# EAGLE design USB-DMX-ISOLATED (EAGLE 7.6.0)
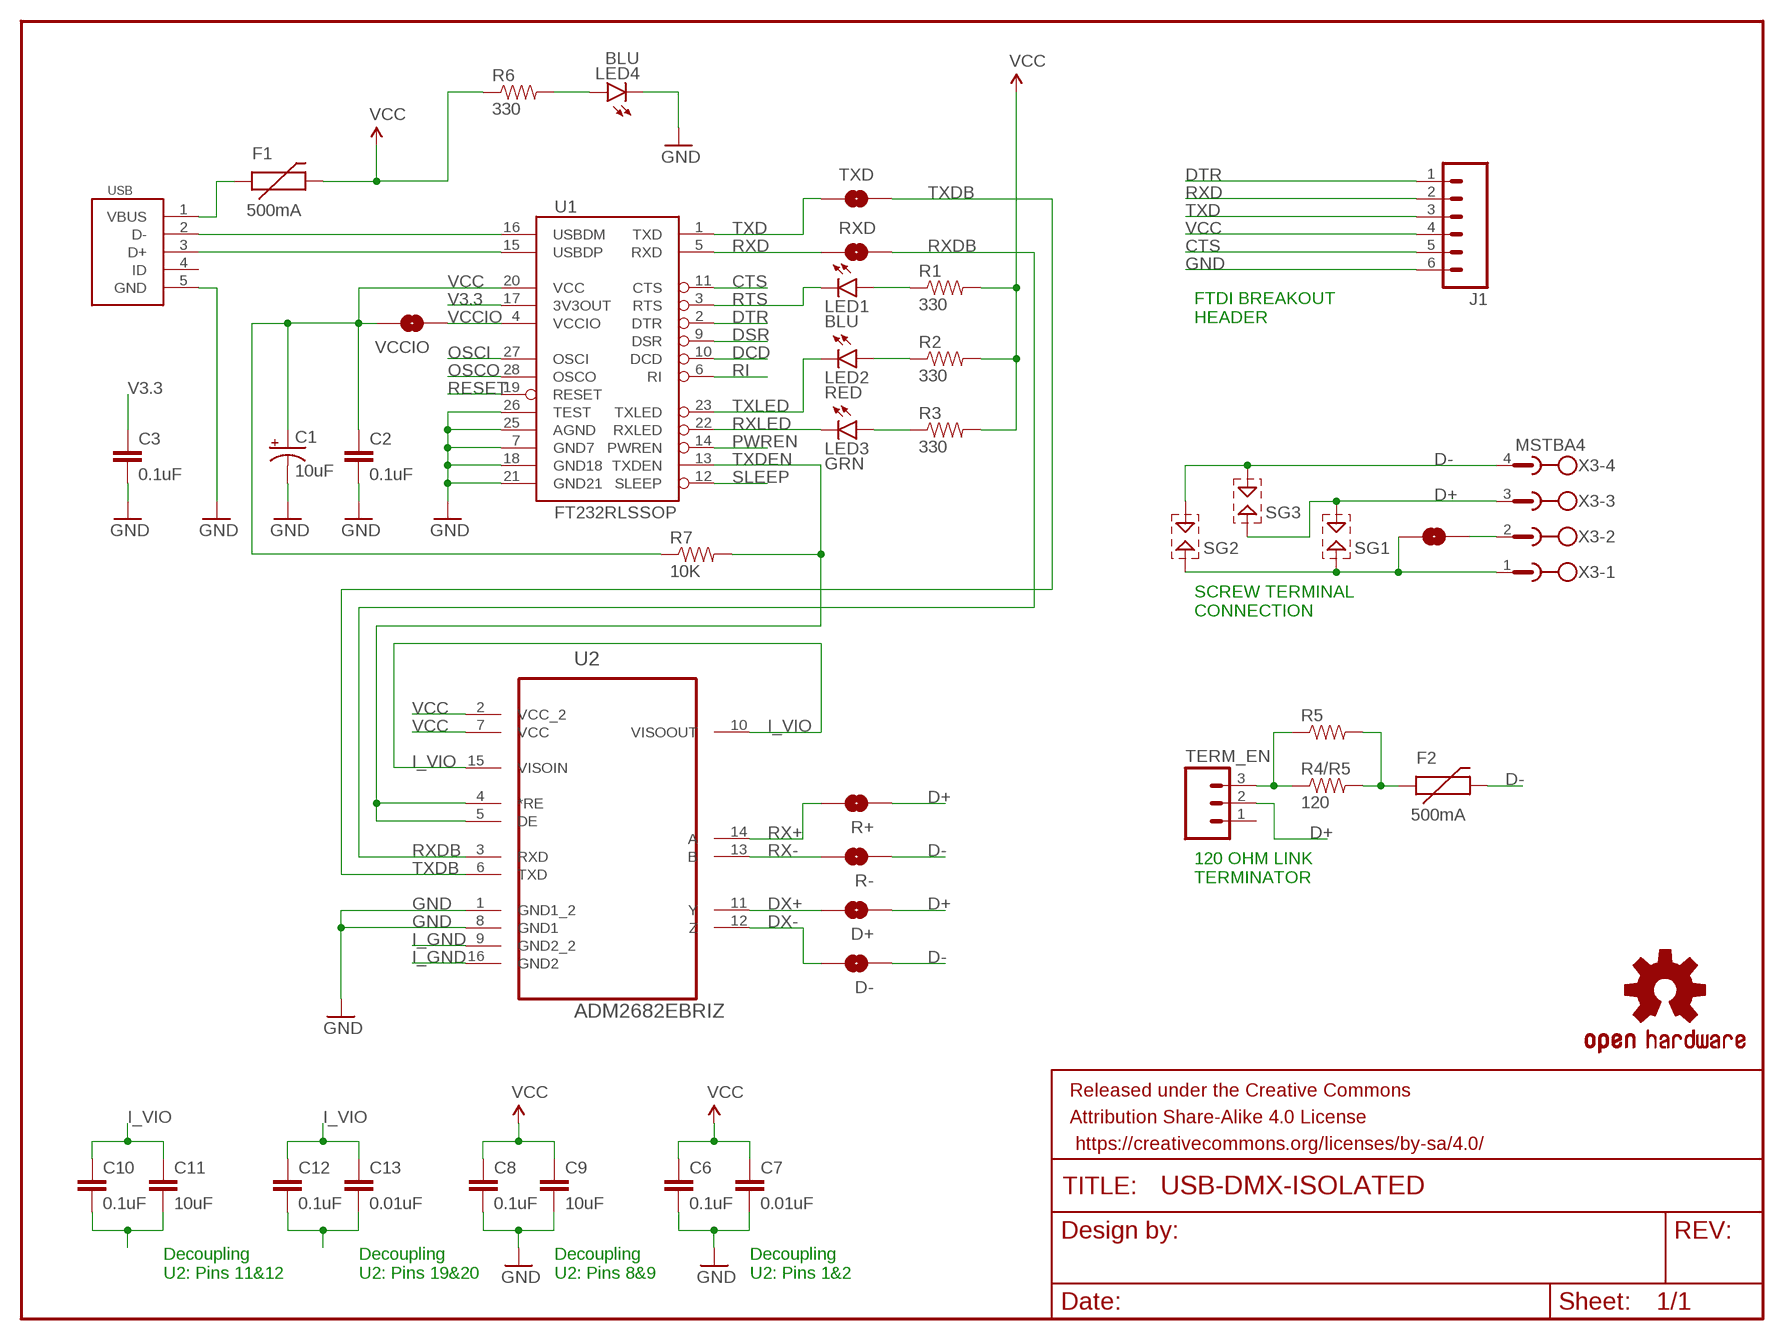
[diagram p0: schematic, sheet 1]

## Parts
C1  10uF  10UF-16V-10%(TANT)  [EIA3216]
C2  0.1uF  CAP1206  [1206]
C3  0.1uF  CAP1206  [1206]
C6  0.1uF  CAP1206  [1206]
C7  0.01uF  CAP1206  [1206]
C8  0.1uF  CAP1206  [1206]
C9  10uF  CAP1206  [1206]
C10  0.1uF  CAP1206  [1206]
C11  10uF  CAP1206  [1206]
C12  0.1uF  CAP1206  [1206]
C13  0.01uF  CAP1206  [1206]
D+  SOLDERJUMPERTRACE  [SJ_2S-TRACE]
D-  SOLDERJUMPERTRACE  [SJ_2S-TRACE]
F1  500mA  PTCSMD  [PTC-1206]
F2  500mA  PTCSMD  [PTC-1206]
FRAME1  FRAME-LETTERNO_PACKAGE  [DUMMY]
J1  M06LOCK  [1X06_LOCK]
LED1  BLU  LED1206  [LED-1206]
LED2  RED  LED1206  [LED-1206]
LED3  GRN  LED1206  [LED-1206]
LED4  BLU  LED1206  [LED-1206]
LOGO1  OSHW-LOGOS  [OSHW-LOGO-S]
P2_COM  SOLDERJUMPERTRACE  [SJ_2S-TRACE]
R1  330  RESISTOR1206  [1206]
R2  330  RESISTOR1206  [1206]
R3  330  RESISTOR1206  [1206]
R4/R5  120  RESISTOR1206  [1206]
R5  RESISTORPTH-1W  [AXIAL-0.6]
R6  330  RESISTOR1206  [1206]
R7  10K  RESISTOR1206  [1206]
R+  SOLDERJUMPERTRACE  [SJ_2S-TRACE]
R-  SOLDERJUMPERTRACE  [SJ_2S-TRACE]
RXD  SOLDERJUMPERTRACE  [SJ_2S-TRACE]
SG1  SPARK-GAP-8  [SPARK-GAP-8]
SG2  SPARK-GAP-8  [SPARK-GAP-8]
SG3  SPARK-GAP-8  [SPARK-GAP-8]
TERM_EN  M03LOCK  [1X03_LOCK]
TXD  SOLDERJUMPERTRACE  [SJ_2S-TRACE]
U1  FT232RLSSOP  [SSOP28DB]
U2  ADM2682EBRIZ  [SOIC127P1032X265-16N]
USB  USB-CON-5PIN-105017-0001  [USB-MICRO-MOLEX-105017-0001]
VCCIO  SOLDERJUMPERTRACE  [SJ_2S-TRACE]
X3  MSTBA4  [MSTBA4]

## Nets
CTS: J1.5 U1.11(CTS)
D+: D+.1 R+.1 SG1.1 SG3.2 TERM_EN.2 X3.3
D-: D-.1 F2.2 R-.1 SG2.1 SG3.1 X3.4
DCD: U1.10(DCD)
DSR: U1.9(DSR)
DTR: J1.1 U1.2(DTR)
DX+: D+.2 U2.11(Y)
DX-: D-.2 U2.12(Z)
GND: C1.C(-) C2.2 C3.2 C6.2 C7.2 C8.2 C9.2 J1.6 LED4.C U1.7(GND7) U1.18(GND18) U1.21(GND21) U1.25(AGND) U1.26(TEST) U2.1(GND1_2) U2.8(GND1) USB.5(GND)
I_GND: C10.2 C11.2 C12.2 C13.2 P2_COM.1 SG1.2 SG2.2 U2.9(GND2_2) U2.16(GND2) X3.1
I_VIO: C10.1 C11.1 C12.1 C13.1 U2.10(VISOOUT) U2.15(VISOIN)
N$1: LED4.A R6.2
N$2: P2_COM.2 X3.2
N$3: R4/R5.1 R5.P$1 TERM_EN.3
N$4: F2.1 R4/R5.2 R5.P$2
N$7: LED3.A R3.1
N$8: LED1.A R1.1
N$9: LED2.A R2.1
OSCI: U1.27(OSCI)
OSCO: U1.28(OSCO)
PWREN: U1.14(PWREN)
RESET: U1.19(RESET)
RI: U1.6(RI)
RTS: LED1.C U1.3(RTS)
RX+: R+.2 U2.14(A)
RX-: R-.2 U2.13(B)
RXD: J1.2 RXD.1 U1.5(RXD)
RXDB: RXD.2 U2.3(RXD)
RXLED: LED3.C U1.22(RXLED)
SLEEP: U1.12(SLEEP)
TXD: J1.3 TXD.1 U1.1(TXD)
TXDB: TXD.2 U2.6(TXD)
TXDEN: R7.2 U1.13(TXDEN) U2.4(*RE) U2.5(DE)
TXLED: LED2.C U1.23(TXLED)
USB_D+: U1.15(USBDP) USB.3(D+)
USB_D-: U1.16(USBDM) USB.2(D-)
V3.3: C3.1 U1.17(3V3OUT)
VBUS: F1.1 USB.1(VBUS)
VCC: C1.A(+) C2.1 C6.1 C7.1 C8.1 C9.1 F1.2 J1.4 R1.2 R2.2 R3.2 R6.1 R7.1 U1.20(VCC) U2.2(VCC_2) U2.7(VCC) VCCIO.2
VCCIO: U1.4(VCCIO) VCCIO.1
Unconnected: TERM_EN.1 USB.4(ID)

## Notes on the sheet
- FTDI BREAKOUT
  HEADER
- SCREW TERMINAL
  CONNECTION
- 120 OHM LINK
  TERMINATOR
- Decoupling
  U2: Pins 11&12
- Decoupling
  U2: Pins 19&20
- Decoupling
  U2: Pins 8&9
- Decoupling
  U2: Pins 1&2

## Library data of the parts
C1 = SparkFun-Capacitors:10UF-16V-10%(TANT): CAP-00811 1206/EIA-3216 Tantalum capacitor; PROD_ID: CAP-00811
C2 C3 C6-C13 = SparkFun-Passives:CAP: Capacitor Standard 0603 ceramic capacitor, and 0.1" leaded capacitor.
D+ D- P2_COM R+ R- RXD TXD VCCIO = SparkFun-Retired:SOLDERJUMPER: Solder Jumper Standard SMD solder jumper. Used to automate production. Two varients : Normally Open and Normally Closed are the same, but have different paste layers. NC will have a large amount of paste and should jumper during reflow.
F1 F2 = SparkFun-PowerIC:PTC: Resettable Fuse PTC Resettable Fuse. Spark Fun Electronics SKU : COM-08357; PROD_ID: RES-11150
FRAME1 = SparkFun-Aesthetics:FRAME-LETTER: Schematic Frame Standard 8.5x11 US Letter frame; DESIGNER: Nobody; VERSION: v01
J1 = SparkFun-Connectors:M06: Header 6 Standard 6-pin 0.1" header. Use with straight break away headers (SKU : PRT-00116), right angle break away headers (PRT-00553), swiss pins (PRT-00743), machine pins (PRT-00117), and female headers (PRT-00115). Molex polarized connector foot print use with SKU : PRT-08094 with associated crimp pins and housings. NOTES ON THE VARIANTS LOCK and LOCK_LONGPADS... This footprint was designed to help hold the alignment of a through-hole component (i.e. 6-pin header) while soldering it into place. You may notice that each hole has been shifted either up or down by 0.005 of an inch from it's more standard position (which is a perfectly straight line). This slight alteration caused the pins (the squares in the middle) to touch the edges of the holes. Because they are alternating, it causes a "brace" to hold the component in place. 0.005 has proven to be the perfect amount of "off-center" position when using our standard breakaway headers. Although looks a little odd when you look at the bare footprint, once you have a header in there, the alteration is very hard to notice. Also,if you push a header all the way into place, it is covered up entirely on the bottom side. This idea of altering the position of holes to aid alignment will be further integrated into the Sparkfun Library for other footprints. It can help hold any component with 3 or more connection pins.
LED1-LED4 = SparkFun-LED:LED: LEDs Standard schematic elements and footprints for 5mm, 3mm, 1206, and 0603 sized LEDs. 5mm - Spark Fun Electronics SKU : COM-00529 (and others)
LOGO1 = SparkFun-Aesthetics:OSHW-LOGO: Open Source Hardware Logo This logo indicates the piece of hardware it is found on incorporates a OSHW license and/or adheres to the definition of open source hardware found here: http://freedomdefined.org/OSHW
R1-R3 R4/R5 R5-R7 = SparkFun-Passives:RESISTOR: Resistor Basic schematic elements and footprints for 0603, 1206, and PTH resistors.
SG1-SG3 = supressor:SPARK-GAP-: SPARK GAP
TERM_EN = SparkFun-Connectors:M03: Header 3 Standard 3-pin 0.1" header. Use with straight break away headers (SKU : PRT-00116), right angle break away headers (PRT-00553), swiss pins (PRT-00743), machine pins (PRT-00117), and female headers (PRT-00115). Molex polarized connector foot print use with SKU : PRT-08232 with associated crimp pins and housings.
U1 = SparkFun-DigitalIC:FT232RL: USB UART FT232RL 4th Generation USB UART (USB <-> Serial) Controller. Spark Fun Electronics SKU : COM-00650 Production SKU IC-00870; PROD_ID: IC-00870
U2 = ADI-Phase-2:ADM2682EBRIZ: TRANSCEIVER, ISO, RS485; MPN: ADM2682EBRIZ; OC_FARNELL: 2008783; OC_NEWARK: 58T8844; PACKAGE: SOIC-16-W; SUPPLIER: Analog Devices
USB = GeekAmmo:USB-CON-5PIN: Molex Micro USB 105017-0001
X3 = con-phoenix-508:MSTBA4: PHOENIX; MF: FARNELL; MPN: 1757268; OC_FARNELL: 3705195; OC_NEWARK: 71C4163

## Board
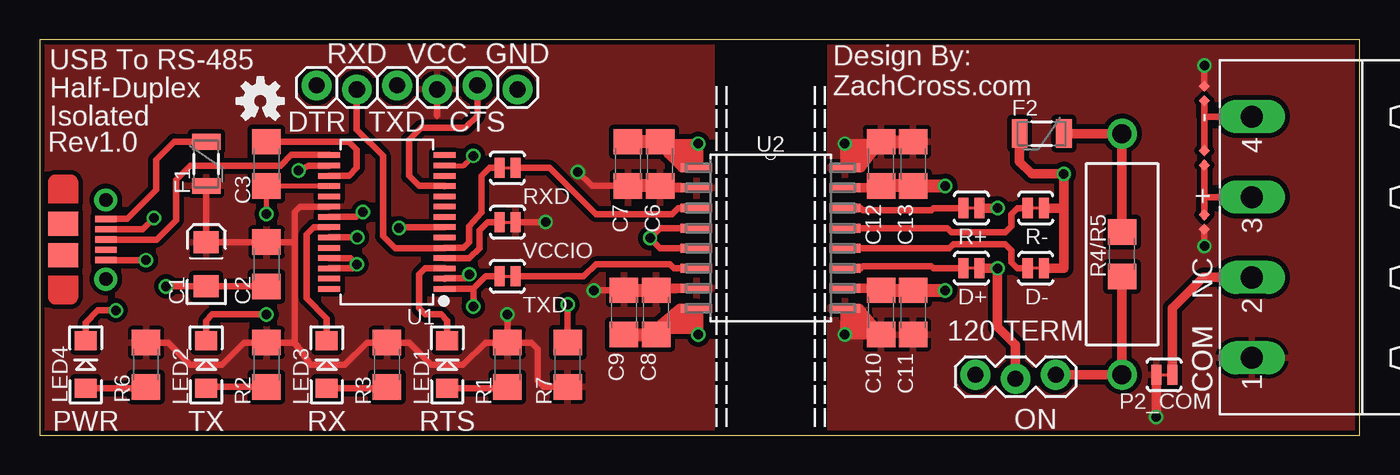
[diagram p1: board, top side]
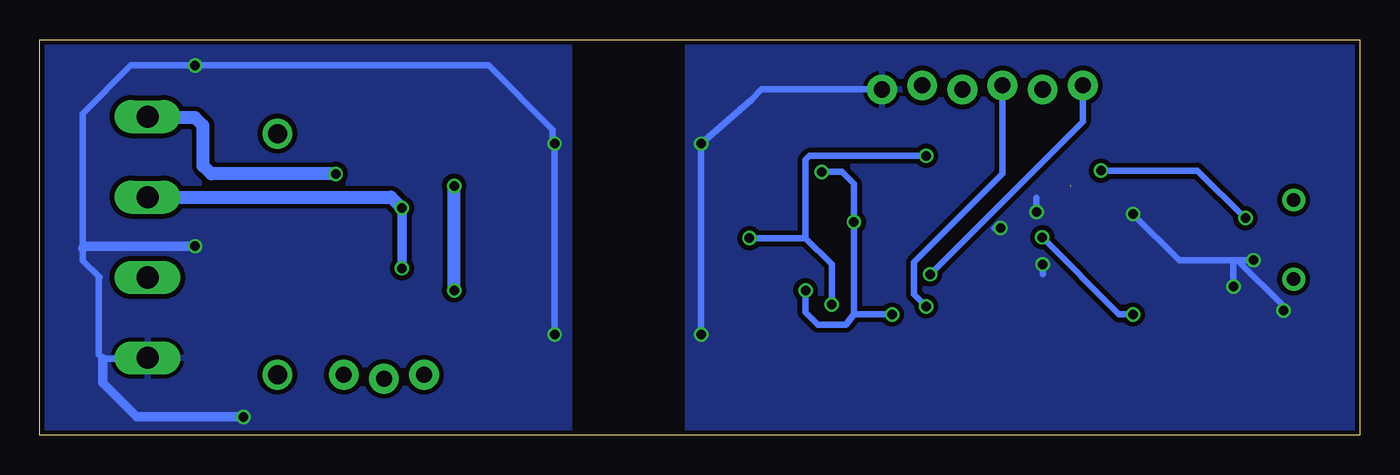
[diagram p2: board, bottom side, seen from below]

Size 83.5 x 25 mm. Coordinates in mm from the lower left corner, seen from the top.
Outline: 0,0 83.49,0 83.5,25 0,25 0,0
Copper layers (1*16): Top 0.035mm / dielectric 1.5mm / Bottom 0.035mm
Design rules "SeeedStudio_2layer_DRU_no_angle_20140221": minimum track width 6mil, minimum drill 12mil, track to track 6mil, track to pad 6mil, pad to pad 6mil, via to via 6mil, smd to smd 0mil, copper to edge 10mil, drill to drill 10mil, minimum pad ring 10mil, minimum via ring 6mil, stop-mask expansion 2mil, vias tented up to drill 100mil, thermal gap 10mil

### Footprints (pad centres in the part's own frame; a part is rotated, then mirrored left to right if it is on the bottom)
EIA3216 = smd 1.4 x 1.6: A 1.4,0; C -1.4,0
1206 = smd 1.6 x 1.8: 1 -1.4,0; 2 1.4,0
SJ_2S-TRACE = smd 0.635 x 1.27: 1 -0.508,0; 2 0.508,0
PTC-1206 = smd 1 x 1.8: 1 -1.4,0; 2 1.4,0
1X06_LOCK = drill 1.016 pad 1.88: 1 0,0; 2 2.54,-0.254; 3 5.08,0; 4 7.62,-0.254; 5 10.16,0; 6 12.7,-0.254
LED-1206 = smd 1.2 x 1.4: A -1.5,0; C 1.5,0
AXIAL-0.6 = drill 1.2 pad 1.88: P$1 -7.62,0; P$2 7.62,0
SPARK-GAP-8 = smd 0.508 x 0.508 rotated 45: 1 -0.457,0; 2 0.457,0
1X03_LOCK = drill 1.016 pad 1.88: 1 0,0.127; 2 2.54,-0.127; 3 5.08,0.127
SSOP28DB = smd 0.348 x 1.397: 1 -4.225,-3.656; 2 -3.575,-3.656; 3 -2.925,-3.656; 4 -2.275,-3.656; 5 -1.625,-3.656; 6 -0.975,-3.656; 7 -0.325,-3.656; 8 0.325,-3.656; 9 0.975,-3.656; 10 1.625,-3.656; 11 2.275,-3.656; 12 2.925,-3.656; 13 3.575,-3.656; 14 4.225,-3.656; 15 4.225,3.656; 16 3.575,3.656; 17 2.925,3.656; 18 2.275,3.656; 19 1.625,3.656; 20 0.975,3.656; 21 0.325,3.656; 22 -0.325,3.656; 23 -0.975,3.656; 24 -1.625,3.656; 25 -2.275,3.656; 26 -2.925,3.656; 27 -3.575,3.656; 28 -4.225,3.656
SOIC127P1032X265-16N = smd 1.981 x 0.559: 1 -4.699,4.445; 2 -4.699,3.175; 3 -4.699,1.905; 4 -4.699,0.635; 5 -4.699,-0.635; 6 -4.699,-1.905; 7 -4.699,-3.175; 8 -4.699,-4.445; 9 4.699,-4.445; 10 4.699,-3.175; 11 4.699,-1.905; 12 4.699,-0.635; 13 4.699,0.635; 14 4.699,1.905; 15 4.699,3.175; 16 4.699,4.445
USB-MICRO-MOLEX-105017-0001 = smd 0.4 x 1.35: 1 1.2,0; 2 1.85,0; 3 2.5,0; 4 3.15,0; 5 3.8,0 | drill 0.85 pad 1.45: P$1 0,0; P$2 5,0 | smd 1.5 x 1.9: P$3 3.5,-2.7; P$4 1.5,-2.7
MSTBA4 = drill 1.397 long: 1 -7.62,5.08; 2 -2.54,5.08; 3 2.54,5.08; 4 7.62,5.08

### Placement (x,y rotation side)
C1  10.54,10.79 90 top
C2  14.35,10.79 270 top
C3  14.35,17.14 270 top
C6  39.24,17.14 90 top
C7  37.21,17.14 90 top
C8  38.99,7.75 270 top
C9  36.96,7.75 270 top
C10  53.21,7.75 270 top
C11  55.24,7.75 270 top
C12  53.21,17.14 90 top
C13  55.24,17.14 90 top
D+  58.93,10.54 180 top
D-  62.99,10.54 180 top
F1  10.54,17.14 270 top
F2  63.37,19.05 180 top
FRAME1  -1.02,-0.25 0 top
J1  17.53,22.1 0 top
LED1  25.78,4.45 90 top
LED2  10.54,4.45 90 top
LED3  18.16,4.45 90 top
LED4  2.92,4.45 90 top
LOGO1  13.96,21.11 0 top
P2_COM  71.12,3.81 0 top
R1  29.59,4.45 90 top
R2  14.35,4.45 90 top
R3  21.97,4.45 90 top
R4/R5  68.45,11.43 90 top
R5  68.45,11.43 90 top
R6  6.73,4.45 270 top
R7  33.4,4.45 90 top
R+  58.93,14.35 180 top
R-  62.99,14.35 180 top
RXD  29.59,16.89 0 top
SG1  73.66,13.46 270 top
SG2  73.66,21.59 90 top
SG3  73.66,17.53 270 top
TERM_EN  59.18,3.68 0 top
TXD  29.59,10.03 0 top
U1  21.97,13.46 90 top
U2  46.23,12.45 0 top
USB  4.19,14.86 270 top
VCCIO  29.59,13.46 0 top
X3  81.75,12.5 90 top

### Tracks (layer width: path | path; a pad name or v marks a point on that pad's centre or on a via)
CTS
  Top 0.406: J1.5 27.69,20.19 26.92,19.43 24.13,19.43 23.37,18.67 23.37,16.38 24,15.75 25.62,15.75 U1.11
D+  (via drill 0.6)
  Top 0.406: SG3.2 73.66,15.04 | SG1.1 73.66,15.04 | X3.3 73.66,15.04
  Top 0.61: D+.1 v60.58,10.54 60.58,6.86 61.72,5.71 TERM_EN.2 | v60.58,14.35 R+.1
  Bottom 0.61: v60.58,10.54 v60.58,14.35
  Bottom 0.813: X3.3 61.27,15.04 v60.58,14.35
D-  (via drill 0.6)
  Top 0.406: X3.4 73.71,20.12 73.66,20.07 | 73.66,20.07 SG2.1 | 73.66,20.07 SG3.1 | F2.2
  Top 0.61: D-.1 64.77,10.54 64.77,14.35 | 64.77,14.35 R-.1 | 64.77,14.35 v64.77,16.51 62.74,16.51 61.98,17.27 F2.2
  Bottom 0.813: v64.77,16.51 72.64,16.51 73.15,17.02 73.15,19.56 73.66,20.07 76.62,20.07 X3.4
DTR  (via drill 0.6)
  Top 0.406: v27.18,10.16 26.92,9.91 25.65,9.91 U1.2
  Bottom 0.406: J1.1 17.53,19.81 v27.18,10.16
DX+
  Top 0.406: U2.11 51.94,10.54 52.07,10.67 56.39,10.67 56.52,10.54 D+.2
DX-
  Top 0.406: U2.12 57.53,11.81 57.78,12.06 61.09,12.06 61.47,11.68 61.47,10.92 61.85,10.54 D-.2
GND  (via drill 0.6)  (1 unrouted)
  Top 0.305: 18.31,15.74 C3.2 v14.35,13.97 | 22.79,13.14 v22.73,13.08
  Top 0.406: C2.2 C1.C v8,9.39 v8,9.4 | USB.5 v6.72,11.06 v6.73,11.05 | LED4.C 2.92,7.11 3.68,7.87 v4.83,7.87 | 40.01,18.41 39.88,18.55 C6.2 39.75,18.04 | U2.1 41.66,16.89 | 41.66,7.87 U2.8 | 39.12,6.86 39.12,6.47 C8.2 | v41.65,6.35 v41.66,6.35 | U1.7 22.79,13.14 | U1.26 19.81,10.54 v20.07,10.79 19.67,11.19 U1.25 | U1.21 20.01,13.79 v20.45,14.1
  Top 0.61: 41.66,16.89 v41.66,18.41 39.37,18.41 | v41.66,6.35 41.66,7.87 | U2.1 40.64,16.89 39.75,17.78 39.75,18.04 | U2.8 40.51,8 39.12,6.86
  Top 0.813: C6.2 C7.2 | C9.2 C8.2
  Bottom 0.406: v6.73,11.05 7.75,11.05 | 7.75,11.05 7.87,11.05 | 7.87,11.05 11.43,11.05 v14.35,13.97 | v8,9.4 8,10.92 7.87,11.05 | v4.83,7.87 4.83,8.13 7.75,11.05 | v41.66,6.35 v41.66,18.41 38.48,21.21 37.85,21.84 J1.6 | v22.73,13.08 23.11,13.08 | v20.07,10.79 20.07,10.16 | v20.45,14.1 20.45,14.99
  pour Bottom (isolate 0.305): 0,25 42.5,25 42.5,0 0,0
I_GND  (via drill 0.6)
  Top 0.406: C13.2 | v73.66,23.37 SG2.2 73.66,23.11 | SG1.2 v73.66,11.94
  Top 0.61: C12.2 51.94,16.89 U2.16 v50.93,18.41 53.21,18.41 | C10.2 51.82,8 U2.9 v50.93,6.35 C10.2 | P2_COM.1 v70.61,1.14
  Top 0.813: C12.2 C13.2
  Bottom 0.406: v50.93,6.35 v50.93,18.41 51.05,18.54 51.05,19.3 55.12,23.37 v73.66,23.37 | X3.1 76.72,4.83 79.5,4.83 79.76,5.08 79.76,9.91 79.7,9.96 80.77,11.03 80.77,11.81 80.77,20.32 77.72,23.37 v73.66,23.37 | v73.66,23.37 73.91,23.37
  Bottom 0.61: v70.61,1.14 77.34,1.14 79.5,3.3 79.5,4.83 | v73.66,11.94 80.64,11.94 80.77,11.81
  pour Top (isolate 0.305): 50,25 83.5,25 83.5,0 50,0
  pour Bottom (isolate 0.305): 83.5,25 50,25 50,0 83.5,0
I_VIO  (via drill 0.6)
  Top 0.406: C13.1 | 53.09,15.62 C12.1 | 52.45,9.27 C10.1
  Top 0.61: U2.15 53.09,15.62 | U2.10 52.45,9.27
  Top 0.813: C10.1 C11.1 56.89,9.15 v57.28,9.14 | C13.1 C12.1 | C13.1 v57.28,15.75
  Bottom 0.813: v57.28,9.14 v57.28,15.75
N$1
  Top 0.406: LED4.A 6.63,2.94 R6.2
N$2
  Top 0.61: X3.2 73.59,9.96 71.63,8 P2_COM.2
N$3
  Top 0.61: R4/R5.1 R5.P$1 TERM_EN.3
N$4
  Top 0.61: R4/R5.2 R5.P$2 F2.1
N$7
  Top 0.406: LED3.A 21.87,2.94 R3.1
N$8
  Top 0.406: LED1.A 29.49,2.94 R1.1
N$9
  Top 0.406: R2.1 10.64,3.04 LED2.A
N$10
  Top 0.406: 51.05,7.49 52.2,7.49 52.2,6.73 51.31,6.73 51.31,7.11 51.94,7.11
N$11
  Top 0.406: 51.18,17.27 52.2,17.27 52.2,18.03 51.31,18.03 51.31,17.53 51.94,17.53 51.94,17.78 51.69,17.78
N$12
  Top 0.406: 40.01,18.03 41.27,18.03 41.27,17.27 40.26,17.27 40.26,17.65 41.02,17.65
N$13
  Top 0.406: 40.26,7.24 40.13,7.24 40.01,7.11 | 40.01,7.11 40.01,6.6 41.4,6.6 41.4,7.62 40.39,7.62 40.01,7.24 40.01,7.11 | 40.01,7.11 40.26,6.86 41.15,6.86 41.15,7.37 40.39,7.37 40.26,7.24 | 40.26,7.24 40.39,7.11 40.77,7.11
RTS
  Top 0.406: U1.3 24.38,10.54 24,10.16 24,8 24.38,7.62 25.4,7.62 25.78,7.24 LED1.C
RX+
  Top 0.406: U2.14 51.94,14.35 52.07,14.22 56.39,14.22 56.52,14.35 R+.2
RX-
  Top 0.406: U2.13 57.4,13.08 57.66,12.83 61.09,12.83 61.47,13.21 61.47,13.97 61.85,14.35 R-.2
RXD
  Top 0.406: RXD.1 28.45,16.89 27.94,16.38 27.94,14.1 27.18,13.21 27.18,12.19 26.82,11.84 U1.5 25.6,11.81 22.48,11.81 21.72,12.57 21.72,17.65 20.07,19.3 J1.2
RXDB
  Top 0.406: U2.3 40.39,14.35 40.01,13.97 35.18,13.97 32.26,16.89 RXD.2
RXLED
  Top 0.406: LED3.C 18.16,7.37 16.89,8.64 16.89,12.7 17.33,13.14 U1.22
TXD  (via drill 0.6)
  Top 0.406: U1.1 27.4,9.24 27.43,9.27 | TXD.1 28.19,10.03 27.43,9.27 | v27.43,8.13 27.43,9.27
  Bottom 0.406: J1.3 22.61,16.51 28.19,10.92 28.19,8.89 v27.43,8.13
TXDB
  Top 0.406: U2.6 40.13,10.54 39.88,10.79 35.18,10.79 34.42,10.03 TXD.2
TXDEN  (via drill 0.6)
  Top 0.305: U1.13 26.82,17.04 v27.43,17.65
  Top 0.406: U2.5 39.24,11.81 v38.61,12.45 39.24,13.08 U2.4 | v33.4,8.26 R7.2
  Bottom 0.406: v38.61,12.45 35.05,12.45 | 35.05,12.45 33.4,10.79 v33.4,8.26 | v27.43,17.65 34.8,17.65 35.05,17.4 35.05,12.45
TXLED  (via drill 0.6)
  Top 0.305: 20.08,12.49 v20.09,12.5
  Top 0.406: LED2.C 10.54,7.24 10.92,7.62 v14.35,7.62 | U1.23 20.08,12.49
  Bottom 0.406: v14.35,7.62 15.24,7.62 15.24,7.64 v20.09,12.5
USB_D+
  Top 0.305: 18.3,17.7 U1.15
  Top 0.406: USB.3 7.41,12.36 8.64,13.59 8.64,16.13 9.53,17.02 15.24,17.02 15.93,17.7 18.3,17.7
USB_D-  (via drill 0.6)
  Top 0.406: USB.2 6.53,13.01 v7.24,13.72 | U1.16 17.4,17.02 17.02,17.02 v16.38,16.71
  Bottom 0.406: v16.38,16.71 10.29,16.71 v7.24,13.72
V3.3
  Top 0.406: U1.17 19.56,16.39 20.07,16.89 20.07,18.03 19.55,18.55 C3.1
VBUS
  Top 0.406: USB.1 5.53,13.66 7.37,15.49 7.37,17.4 8.51,18.54 F1.1
VCC  (via drill 0.6)
  Top 0.305: C2.1 16.13,12.19
  Top 0.406: R6.1 8.12,5.84 9.53,4.45 11.56,4.45 12.95,5.84 R2.2 16.13,5.84 | F1.2 C1.A C2.1 | C2.1 | 39.37,15.62 C6.1 | 39.11,9.27 C8.1 | R7.1 31.88,3.04 31.5,3.43 31.5,5.46 31.11,5.84 R1.2 | R1.2 28.19,5.84 26.8,4.45 24.77,4.45 23.36,5.84 R3.2 20.7,5.84 19.3,4.45 17.14,4.45 16.13,5.84 | VCCIO.2 v32,13.46 | C7.1 34.92,15.75 v34.04,16.64 | v35.05,9.14 C9.1 | U1.20 16.47,14.44 16.13,14.1 16.13,12.19 | 16.13,12.19 C2.1 | 16.13,12.19 16.13,5.84 | J1.4 25.15,20.19 | R1.2 v29.59,7.62
  Top 0.61: U2.2 39.37,15.62 | U2.7 39.11,9.27
  Top 0.813: C6.1 C7.1 | C9.1 C8.1
  Bottom 0.406: 32,7.62 v32,13.46 32,15.88 32.77,16.64 v34.04,16.64 | 32,7.62 32.51,6.99 34.29,6.99 35.05,7.75 v35.05,9.14 | v29.59,7.62 32,7.62
  pour Top (isolate 0.305): 0,25 42.5,25 42.5,0 0,0
VCCIO
  Top 0.406: U1.4 26.91,11.19 27.18,11.18 27.81,11.81 27.81,12.95 28.32,13.46 VCCIO.1

### Text on the board
tNames: RXD | VCC | GND | Design By: / ZachCross.com | USB To RS-485 | Half-Duplex | Isolated | - | Rev1.0 | DTR | TXD | CTS | U2 | + | NC | 120 TERM | COM | COM | PWR | TX | RX | RTS | ON | =============== | ===============